# EAGLE design Nano V2.0 20170111 (EAGLE 7.5.0)
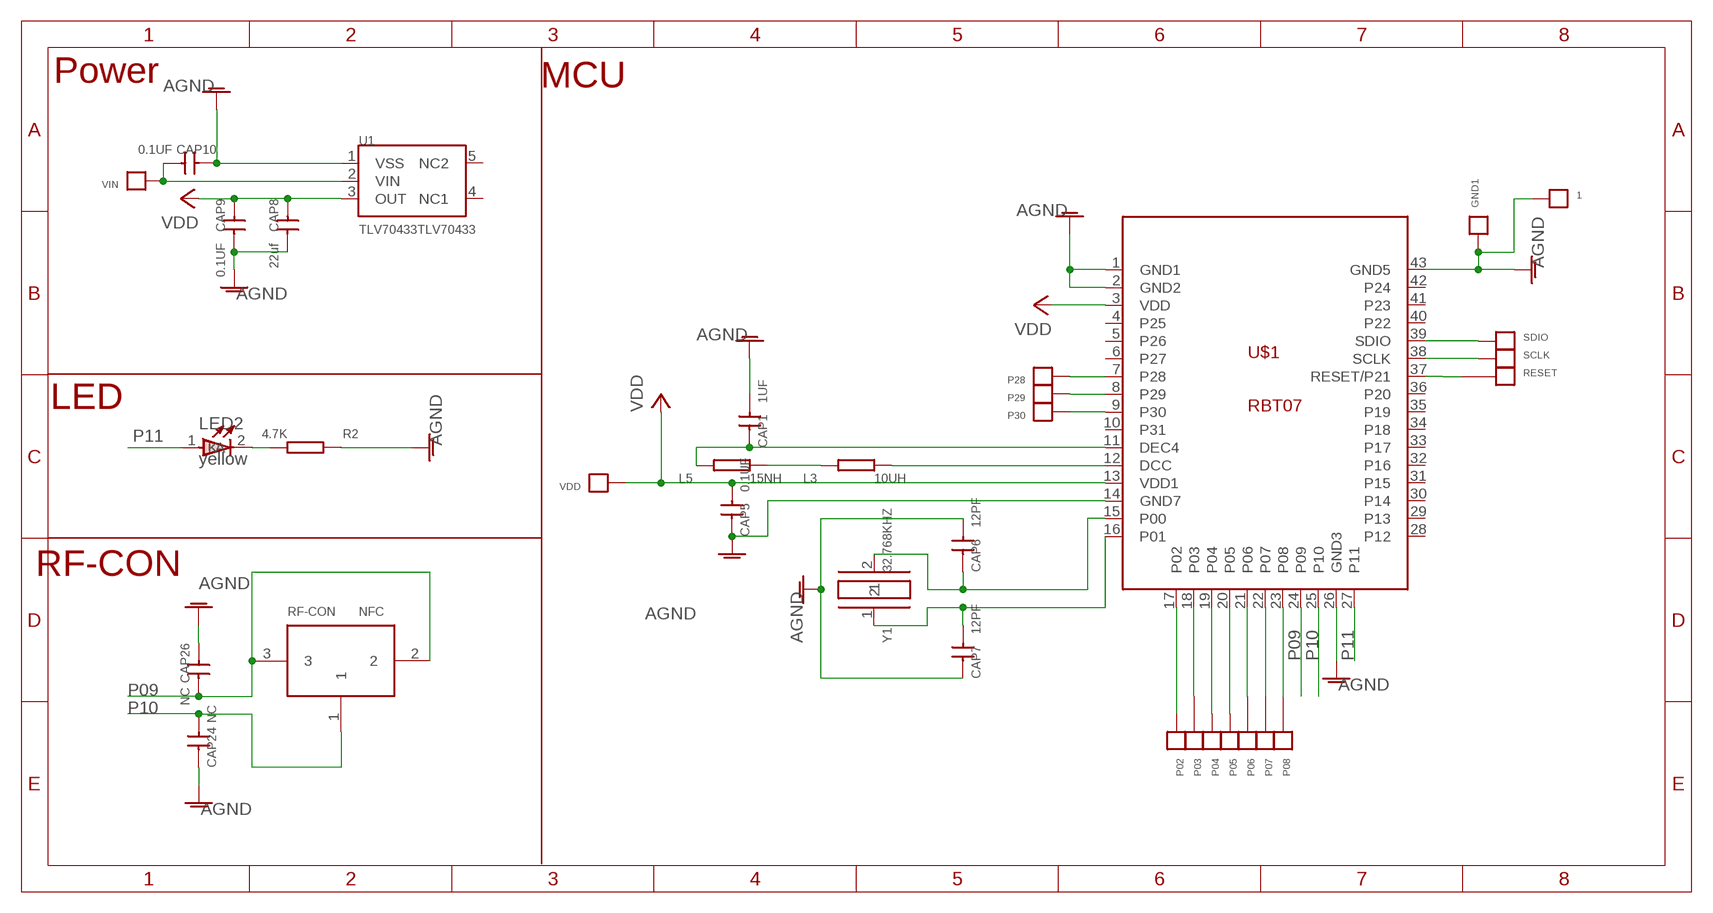
[diagram p0: schematic, sheet 1]

## Parts
1  TPDOT_1  [DOT_1]
CAP1  1UF  CAP0402  [C-0402]
CAP5  0.1UF  CAP0402  [C-0402]
CAP6  12PF  CAP0402  [C-0402]
CAP7  12PF  CAP0402  [C-0402]
CAP8  22uf  CAPC0805  [C0805]
CAP9  0.1UF  CAP0402  [C-0402]
CAP10  0.1UF  CAP0402  [C-0402]
CAP24  NC  CAP0402  [C-0402]
CAP26  NC  CAP0402  [C-0402]
GND1  TPDOT_1.5  [DOT_1.5]
L3  10UH  RESR0603  [R0603]
L5  15NH  RESR0402  [R0402]
LED2  yellow  LED  [LED0603]
P02  TPDOT_1.5  [DOT_1.5]
P03  1P  [1P]
P04  TPDOT_1.5  [DOT_1.5]
P05  TPDOT_1.5  [DOT_1.5]
P06  1P  [1P]
P07  1P  [1P]
P08  1P  [1P]
P28  TPTPEB  [TPEB]
P29  TPDOT_1.5  [DOT_1.5]
P30  TPDOT_1.5  [DOT_1.5]
R2  4.7K  RESR0402  [R0402]
RESET  1P  [1P]
RF-CON  NFC  IPEXIPEX  [IPEX]
SCLK  TPDOT_1.5  [DOT_1.5]
SDIO  TPDOT_1.5  [DOT_1.5]
U1  TLV70433TLV70433  [SOT-23-5]
U$1  RBT07  [RBT07]
VDD  TPTPEB  [TPEB]
VIN  TPDOT_1  [DOT_1]
Y1  32.768KHZ  CRY_32153215  [CRY_3215]

## Nets
GND: 1.1 CAP1.1 CAP5.2 CAP6.1 CAP7.2 CAP8.1 CAP9.1 CAP10.2 CAP24.2 CAP26.2 GND1.1 R2.1 U1.1(VSS) U$1.1(GND1) U$1.2(GND2) U$1.14(GND7) U$1.26(GND3) U$1.43(GND5) ; supply symbol labelled AGND
N$1: P30.1 U$1.9(P30)
N$2: L3.2 U$1.12(DCC)
N$3: L3.1 L5.2
N$4: SDIO.1 U$1.39(SDIO)
N$5: CAP1.2 L5.1 U$1.11(DEC4)
N$6: SCLK.1 U$1.38(SCLK)
N$7: CAP6.2 U$1.15(P00) Y1.2
N$8: P03.P$1 U$1.18(P03)
N$9: RESET.P$1 U$1.37(RESET/P21)
N$10: P04.1 U$1.19(P04)
N$11: P05.1 U$1.20(P05)
N$12: P06.P$1 U$1.21(P06)
N$13: LED2.2(K) R2.2
N$14: P02.1 U$1.17(P02)
N$15: P29.1 U$1.8(P29)
N$16: P28.1 U$1.7(P28)
N$19: CAP7.1 U$1.16(P01) Y1.1
N$20: P07.P$1 U$1.22(P07)
N$21: P08.P$1 U$1.23(P08)
N$29: CAP10.1 U1.2(VIN) VIN.1
P09: CAP26.1 RF-CON.2 RF-CON.3 U$1.24(P09)
P10: CAP24.1 RF-CON.1 U$1.25(P10)
P11: LED2.1(A) U$1.27(P11)
VCC: CAP5.1 CAP8.2 CAP9.2 U1.3(OUT) U$1.3(VDD) U$1.13(VDD1) VDD.1 ; supply symbol labelled VDD
Unconnected: U1.4(NC1) U1.5(NC2) U$1.4(P25) U$1.5(P26) U$1.6(P27) U$1.10(P31) U$1.28(P12) U$1.29(P13) U$1.30(P14) U$1.31(P15) U$1.32(P16) U$1.33(P17) U$1.34(P18) U$1.35(P19) U$1.36(P20) U$1.40(P22) U$1.41(P23) U$1.42(P24)

## Notes on the sheet
- Power | MCU
- LED
- RF-CON

## Library data of the parts
1 GND1 P02 P04 P05 P28-P30 SCLK SDIO VDD VIN = RedBeard:TP
CAP1 CAP5-CAP9 CAP24 = NANO2:CAP: CAP
CAP10 CAP26 = 1RedBeard:CAP: CAP
L3 L5 R2 = 1RedBeard:RES: RES
LED2 = RedBeard:LED: LED
P03 P06-P08 RESET = 1RedBeard:1P
RF-CON = RedBeard:IPEX
U1 = NANO2:TLV70433: TLV70433; U1: TLV70433DBVR
U$1 = 1RedBeard:RBT07
Y1 = RedBeard:CRY_3215

## Net classes
0 default: clearance 0.205 mm

## Board
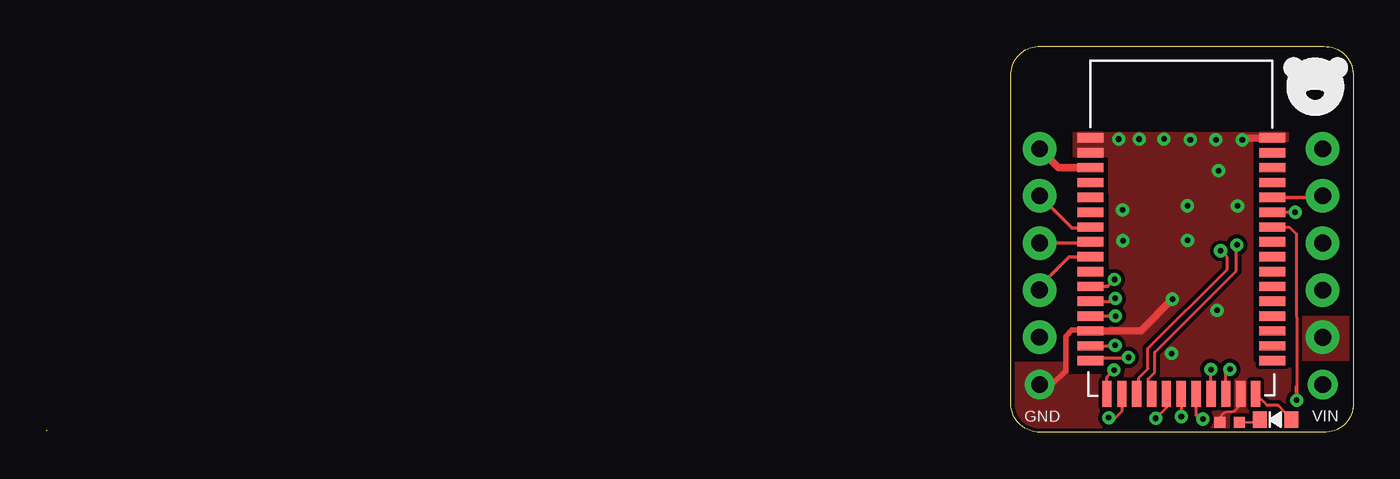
[diagram p1: board, top side]
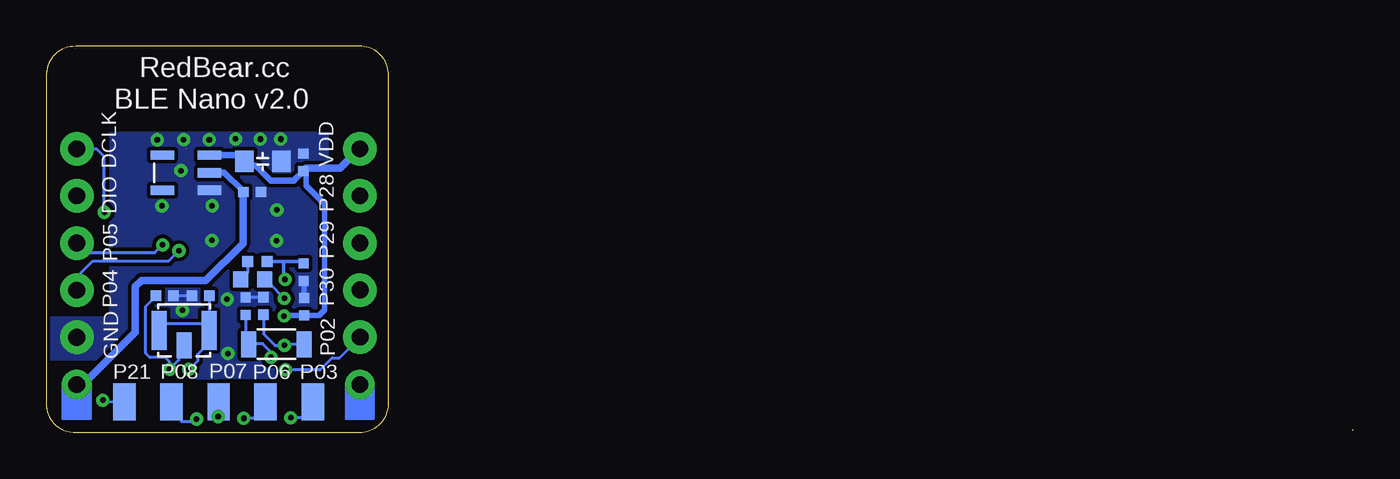
[diagram p2: board, bottom side, seen from below]

Size 70.35 x 20.79 mm. Coordinates in mm from the lower left corner, seen from the top.
Outline: 0,0.09 0.05,0.09
Outline: 70.35,19.32 70.35,1.54 arc-90 68.91,0 53.5,0 arc-90 51.93,1.53 51.93,19.2 arc-90 53.38,20.79 68.78,20.79 arc-90 70.35,19.32
Copper layers (1*16): Top 0.035mm / dielectric 1.5mm / Bottom 0.035mm
Design rules "MB-N2规则 *": minimum track width 5mil, minimum drill 11mil, track to track 5mil, track to pad 6mil, pad to pad 6mil, via to via 8mil, smd to smd 6mil, copper to edge 8mil, drill to drill 8mil, minimum pad ring 10mil, minimum via ring 8mil, stop-mask expansion 2mil, vias tented up to drill 13mil, thermal gap 20mil

### Footprints (pad centres in the part's own frame; a part is rotated, then mirrored left to right if it is on the bottom)
DOT_1 = drill 0.9 pad 1.6: 1 0,0
C-0402 = smd 0.55 x 0.55: 1 -0.47,0; 2 0.47,0
C0805 = smd 1 x 1.146: 1 -1,0; 2 1,0
DOT_1.5 = drill 0.9 pad 1.8: 1 0,0
R0603 = smd 0.8 x 0.85: 1 -0.65,0; 2 0.65,0
R0402 = smd 0.6 x 0.6: 1 -0.525,0; 2 0.525,0
LED0603 = smd 0.762 x 0.889: 1 -0.85,0; 2 0.85,0
1P = smd 2 x 1.2: P$1 0,-0.01
TPEB = drill 0.9 pad 1.8: 1 0,0
IPEX = smd 0.8 x 1.4: 1 0,-0.8 | smd 0.8 x 2.1: 2 1.35,0; 3 -1.35,0
SOT-23-5 = smd 1.27 x 0.508: 1 -1.27,0.953; 2 -1.27,0; 3 -1.27,-0.953; 4 1.27,-0.953; 5 1.27,0.953
RBT07 = smd 1.4 x 0.5: 1 -0.649,13.085; 2 -0.649,12.285; 3 -0.649,11.485; 4 -0.649,10.685; 5 -0.649,9.885; 6 -0.649,9.085; 7 -0.649,8.285; 8 -0.649,7.485; 9 -0.649,6.685; 10 -0.649,5.885; 11 -0.649,5.085; 12 -0.649,4.285; 13 -0.649,3.485; 14 -0.649,2.685; 15 -0.649,1.885; 16 -0.649,1.085; 28 9.151,1.085; 29 9.151,1.885; 30 9.151,2.685; 31 9.151,3.485; 32 9.151,4.285; 33 9.151,5.085; 34 9.151,5.885; 35 9.151,6.685; 36 9.151,7.485; 37 9.151,8.285; 38 9.151,9.085; 39 9.151,9.885; 40 9.151,10.685; 41 9.151,11.485; 42 9.151,12.285; 43 9.151,13.085 | smd 0.5 x 1.4: 17 0.251,-0.7; 18 1.051,-0.7; 19 1.851,-0.7; 20 2.651,-0.7; 21 3.451,-0.7; 22 4.251,-0.7; 23 5.051,-0.7; 24 5.851,-0.7; 25 6.651,-0.7; 26 7.451,-0.7; 27 8.251,-0.7
CRY_3215 = smd 0.8 x 1.4: 1 -1.5,0; 2 1.5,0

### Placement (x,y rotation side)
1  53.48,2.57 90 top
CAP1  56.51,8.62 90 bottom
CAP5  56.48,6.76 90 bottom
CAP6  58.67,6.8 270 bottom
CAP7  59.62,6.79 90 bottom
CAP8  58.69,14.6 180 bottom
CAP9  56.51,14.55 270 bottom
CAP10  59.27,12.94 0 bottom
CAP24  63.98,7.36 0 bottom
CAP26  62.05,7.36 180 bottom
GND1  68.72,5.11 0 bottom
L3  59.25,8.23 0 bottom
L5  59,9.19 180 bottom
LED2  66.17,0.68 180 top
P02  53.47,5.12 0 top
P03  56.01,1.64 90 bottom
P04  68.72,7.65 0 top
P05  68.72,10.19 0 top
P06  58.55,1.64 270 bottom
P07  61.09,1.64 90 bottom
P08  63.62,1.64 90 bottom
P28  53.48,12.73 0 top
P29  53.48,10.19 0 top
P30  53.47,7.66 0 top
R2  63.7,0.53 0 top
RESET  66.17,1.64 90 bottom
RF-CON  62.94,5.48 0 bottom
SCLK  68.72,15.27 0 top
SDIO  68.72,12.73 0 top
U1  62.84,13.98 180 bottom
U$1  56.85,2.77 0 top
VDD  53.48,15.27 180 top
VIN  68.72,2.57 90 top
Y1  57.97,4.74 0 bottom

### Tracks (layer width: path | path; a pad name or v marks a point on that pad's centre or on a via)
GND  (via drill 0.3 pad 0.55)
  Top 0.13: U$1.26 64.27,2.04 64.16,1.47 arc-90 63.8,1.1 63.6,1.1 arc90 R2.1
  Top 0.15: 63.17,0.59 R2.1 63.26,0.66
  Top 0.305: 1.1 54.14,2.57 54.88,3.31 54.88,5.17 55.22,5.51 56.14,5.51 U$1.14
  Top 0.406: U$1.14 58.91,5.46 v60.62,7.17 | U$1.43 64.8,15.86 v64.38,15.75
  Bottom 0.15: 63.41,7.19 63.23,7.36 CAP26.2 62.48,7.36 62.48,7.42 | CAP6.1 CAP7.2
  Bottom 0.2: CAP24.2 63.41,7.19
  Bottom 0.3: CAP1.1 56.48,8.12 CAP5.2 56.42,7.23
  other vias: 61.43,12.2 57.94,11.98 57.73,15.79 63.11,14.09 61.44,10.33 63.03,6.57 57.96,10.32 64.13,12.2 60.58,4.24 58.83,15.79 61.59,15.76 62.96,15.76 60.16,15.8
  pour Bottom (no thermals): 49.23,21.83 72.59,21.86 72.59,-1.76 49.21,-1.76 49.21,21.83
  pour Top (no thermals): 73.84,23.62 73.84,-3.68 48.01,-3.68 48.01,23.5
N$1
  Top 0.2: U$1.9 55.06,9.45 53.47,7.86 P30.1
N$2  (via drill 0.3 pad 0.55)
  Top 0.15: U$1.12 57.37,7.06 v57.55,7.21
  Bottom 0.15: L3.2 58.36,8.04 v57.55,7.21
N$3
  Bottom 0.15: L5.2 59.52,8.61 L3.1
N$4
  Top 0.2: U$1.39 68.64,12.66 SDIO.1
N$5  (via drill 0.3 pad 0.55)
  Top 0.2: U$1.11 57.13,7.86 v57.51,8.23
  Bottom 0.2: L5.1 57.57,9.19 | 57.57,9.19 56.51,9.19 CAP1.2 | v57.51,8.23 57.57,8.23 57.57,9.19
N$6  (via drill 0.3 pad 0.55)
  Top 0.15: U$1.38 v67.23,11.85
  Bottom 0.15: SCLK.1 67.66,15.27 67.27,14.88 67.27,11.88 v67.23,11.85
N$7  (via drill 0.3 pad 0.55)
  Top 0.15: U$1.15 57.39,4.66 v57.54,4.68
  Bottom 0.15: Y1.2 57.38,4.74 v57.54,4.68 57.43,4.67 58.04,4.67 58.67,5.3 CAP6.2
N$8  (via drill 0.3 pad 0.55)
  Top 0.15: U$1.18 57.9,1.12 57.56,0.78 v57.2,0.78
  Bottom 0.15: P03.P$1 56,1.35 56.57,0.78 v57.2,0.78
N$9  (via drill 0.3 pad 0.55)
  Top 0.15: U$1.37 66.92,11.06 67.3,10.68 v67.31,1.73 | 67.3,1.62 v67.31,1.73 | v67.31,1.73 67.3,2.49
  Bottom 0.13: RESET.P$1 67.23,1.64 arc90 v67.31,1.73
  Bottom 0.15: 67.27,1.64 v67.31,1.73
N$10  (via drill 0.3 pad 0.55)
  Top 0.15: v63.22,9.78 63.57,9.43 63.57,8.78 59.31,4.52 59.31,3.42 59.07,3.18 58.82,2.93 58.82,2.19 U$1.19
  Bottom 0.15: P04.1 68.72,8.36 67.86,9.22 63.78,9.22 v63.22,9.78 63.23,9.78
N$11  (via drill 0.3 pad 0.55)
  Top 0.15: U$1.20 59.53,2.1 59.53,2.51 59.32,2.71 59.32,2.89 59.67,3.23 59.67,4.31 64.06,8.7 64.06,10.05 v64.09,10.09
  Bottom 0.15: 68.72,10.13 P05.1 68.2,9.67 64.52,9.67 v64.09,10.09
N$12  (via drill 0.3 pad 0.55)
  Top 0.15: U$1.21 60.3,1.32 v59.73,0.75
  Bottom 0.15: P06.P$1 58.84,1.64 58.84,0.85 58.93,0.76 v59.72,0.76 v59.73,0.75
N$13
  Top 0.13: R2.2 65.23,0.53 LED2.2
  Top 0.15: 65.22,0.57 LED2.2
N$14  (via drill 0.3 pad 0.55)
  Top 0.15: U$1.17 57.1,2.97 v57.48,3.35
  Bottom 0.15: v57.48,3.35 55.62,3.35 54.97,4.01 54.58,4.01 P02.1
N$15
  Top 0.2: P29.1 56.13,10.19 U$1.8
N$16
  Top 0.2: P28.1 55.22,10.99 56.13,10.99 U$1.7
N$17
  cutout Top: 65.03,15.61 67,15.62 67.05,3.5 65.05,3.86 65.05,15.78
N$18
  cutout Top: 55.08,14.76 57.09,14.76 57.17,3.16 55.11,3.16 55.11,14.58
N$19  (via drill 0.3 pad 0.55)
  Top 0.15: 56.21,3.87 U$1.16 56.33,3.99 58.22,3.99 v58.26,4.03
  Bottom 0.15: CAP7.1 59.62,4.89 Y1.1 59.45,4.76 58.71,4.76 58.26,4.31 v58.26,4.03
N$20  (via drill 0.3 pad 0.55)
  Top 0.15: U$1.22 v61.1,0.85
  Bottom 0.15: P07.P$1 61.08,0.88 v61.1,0.85
N$21  (via drill 0.3 pad 0.55)
  Top 0.15: v62.27,0.71 61.9,0.91 U$1.23
  Bottom 0.15: 63.62,2 P08.P$1 63.62,1.13 63.07,0.58 62.27,0.58 v62.27,0.71
N$22
  cutout Bottom: 51.94,20.77 70.33,20.77 70.33,16.25 51.96,16.25 51.96,20.74
N$23
  cutout Top: 51.99,20.76 70.34,20.76 70.25,16.26 51.89,16.26
N$24
  cutout Top: 67.05,16.59 70.27,16.59 70.33,6.35 67.05,6.35 66.98,16.56
N$25
  cutout Bottom: 67.03,16.54 70.28,16.54 70.3,6.34 67.06,6.34
N$26
  cutout Bottom: 67.28,3.75 70.3,3.75 70.31,0.12 67.28,0.12
  cutout Bottom: 51.98,3.75 55,3.75 55.01,0.12 51.99,0.12
  cutout Bottom: 55.12,-0.2 55.12,2.82 67.09,2.71 67.09,-0.31
N$27
  cutout Top: 67.28,3.76 70.31,3.76 70.33,0.12 67.31,0.11
N$28
  cutout Top: 51.88,16.51 55.16,16.51 55.16,3.86 51.88,3.86
N$29
  Bottom 0.35: 59.77,13.01 59.8,13.01 60.77,13.98 U1.2
  Bottom 0.4: 59.77,10.18 61.77,8.18 65.23,8.18 65.56,7.84
  Bottom 0.406: 65.56,7.84 65.56,5.38 68.38,2.57 VIN.1 | 59.77,10.18 59.77,13.01 CAP10.1
N$30
  cutout Bottom: 51.88,16.5 55.08,16.5 55.08,3.86 51.88,3.86
P09  (via drill 0.3 pad 0.55)
  Top 0.15: U$1.24 v62.7,3.38
  Bottom 0.15: CAP26.1 61.59,7.18 RF-CON.2 | v62.7,3.38 62.68,3.38 62.22,3.84 62.22,4.19 61.84,4.57 61.84,4.86 61.59,5.11 RF-CON.2 | RF-CON.2 61.58,5.83 64.28,5.83 RF-CON.3
P10  (via drill 0.3 pad 0.55)
  Top 0.15: U$1.25 63.5,3.17 v63.72,3.39
  Bottom 0.15: CAP24.1 64.62,7.36 64.62,7.16 65,6.79 65,4.25 64.78,4.03 63.95,4.03 63.72,3.8 v63.72,3.39 63.22,3.89 63.22,4.06 62.94,4.34 RF-CON.1
P11
  Top 0.15: U$1.27 65.72,1.44 66.32,1.44 66.71,1.05 66.75,1.05 66.75,0.73 67.02,0.73 LED2.1
VCC  (via drill 0.3 pad 0.55)
  Top 0.15: U$1.13 57.31,6.26 v57.56,6.26
  Top 0.406: U$1.3 54.49,14.26 VDD.1
  Bottom 0.3: CAP5.1 55.66,6.29 55.37,6.58 55.37,12.28 56.37,13.28 56.37,14.22 CAP9.2
  Bottom 0.305: CAP5.1 57.53,6.29 v57.56,6.26
  Bottom 0.35: U1.3 59.91,14.93 CAP8.2 59.36,14.38 59.09,14.38 58.29,13.57 57,13.57 57,13.58 CAP9.2
  Bottom 0.406: 56.37,14.22 54.53,14.22 VDD.1 | CAP9.2 56.51,14.06

### Text on the board
tNames: GND | VIN
bNames: RedBear.cc | BLE Nano v2.0 | VDD | DCLK | P28 | DIO | P29 | P05 | P30 | P04 | P02 | GND | P03 | P06 | P07 | P08 | P21